# Altium schematic sheet ssegs_and_registers.SchDoc
size A; SheetNumber: 3; SheetTotal: 4
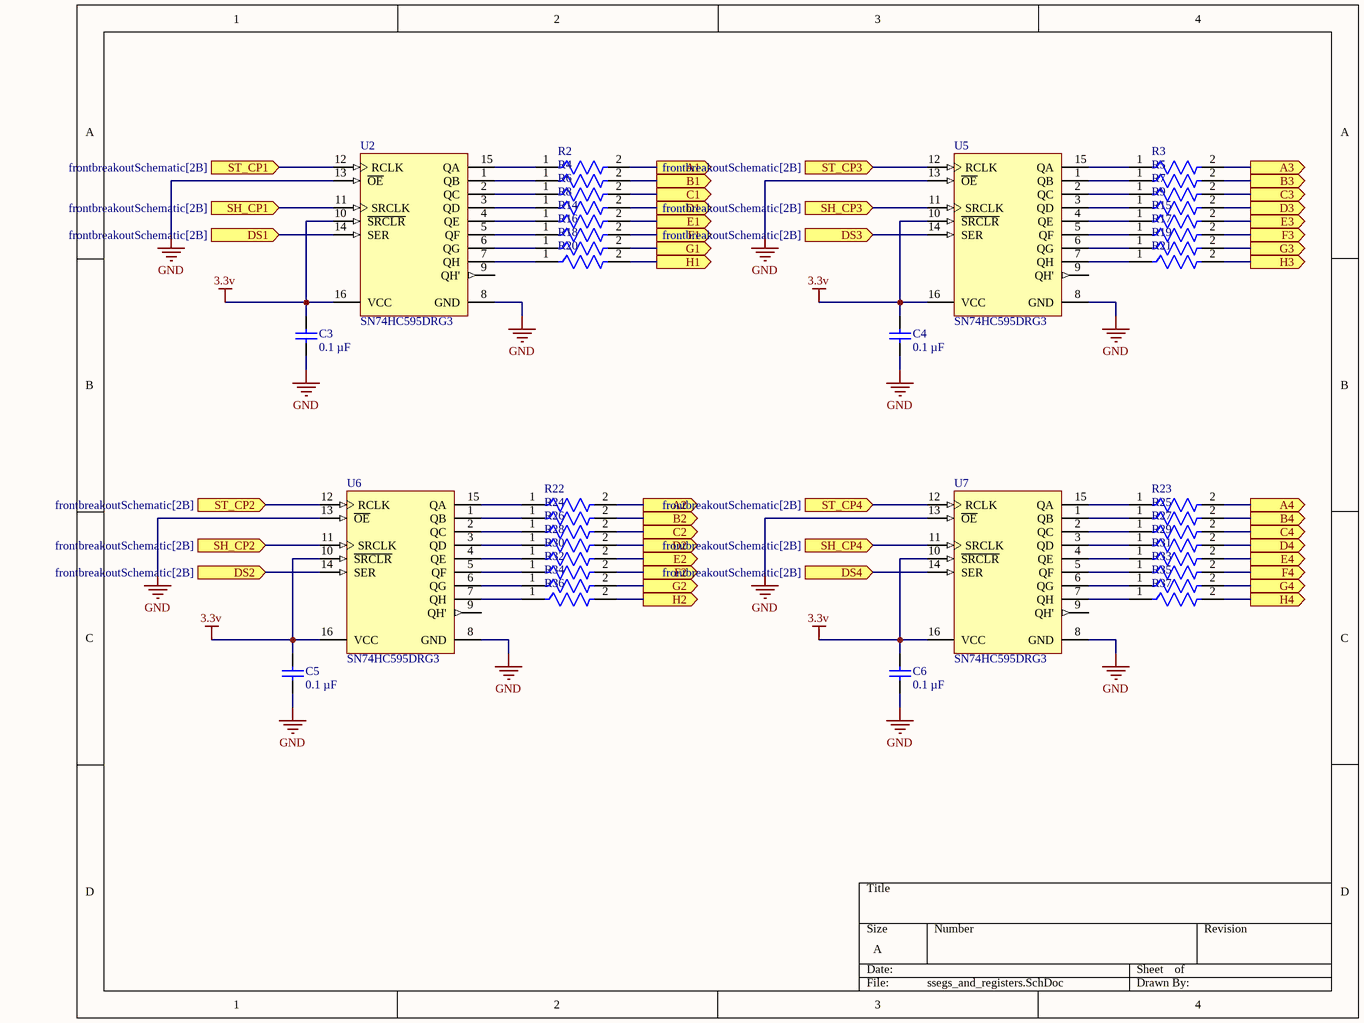
[diagram p0: ssegs_and_registers.SchDoc]

## Parts
C3  0.1 µF  [CAPC2013X140X50NL20T25]
C4  0.1 µF  [CAPC2013X140X50NL20T25]
C5  0.1 µF  [CAPC2013X140X50NL20T25]
C6  0.1 µF  [CAPC2013X140X50NL20T25]
R2  200  [FP-RG2012-IPC_A]  (value not drawn)
R3  200  [FP-RG2012-IPC_A]  (value not drawn)
R4  200  [FP-RG2012-IPC_A]  (value not drawn)
R5  200  [FP-RG2012-IPC_A]  (value not drawn)
R6  200  [FP-RG2012-IPC_A]  (value not drawn)
R7  200  [FP-RG2012-IPC_A]  (value not drawn)
R8  200  [FP-RG2012-IPC_A]  (value not drawn)
R9  200  [FP-RG2012-IPC_A]  (value not drawn)
R14  200  [FP-RG2012-IPC_A]  (value not drawn)
R15  200  [FP-RG2012-IPC_A]  (value not drawn)
R16  200  [FP-RG2012-IPC_A]  (value not drawn)
R17  200  [FP-RG2012-IPC_A]  (value not drawn)
R18  200  [FP-RG2012-IPC_A]  (value not drawn)
R19  200  [FP-RG2012-IPC_A]  (value not drawn)
R20  200  [FP-RG2012-IPC_A]  (value not drawn)
R21  200  [FP-RG2012-IPC_A]  (value not drawn)
R22  200  [FP-RG2012-IPC_A]  (value not drawn)
R23  200  [FP-RG2012-IPC_A]  (value not drawn)
R24  200  [FP-RG2012-IPC_A]  (value not drawn)
R25  200  [FP-RG2012-IPC_A]  (value not drawn)
R26  200  [FP-RG2012-IPC_A]  (value not drawn)
R27  200  [FP-RG2012-IPC_A]  (value not drawn)
R28  200  [FP-RG2012-IPC_A]  (value not drawn)
R29  200  [FP-RG2012-IPC_A]  (value not drawn)
R30  200  [FP-RG2012-IPC_A]  (value not drawn)
R31  200  [FP-RG2012-IPC_A]  (value not drawn)
R32  200  [FP-RG2012-IPC_A]  (value not drawn)
R33  200  [FP-RG2012-IPC_A]  (value not drawn)
R34  200  [FP-RG2012-IPC_A]  (value not drawn)
R35  200  [FP-RG2012-IPC_A]  (value not drawn)
R36  200  [FP-RG2012-IPC_A]  (value not drawn)
R37  200  [FP-RG2012-IPC_A]  (value not drawn)
U2  SN74HC595DRG3  [D0016A_L]
U5  SN74HC595DRG3  [D0016A_L]
U6  SN74HC595DRG3  [D0016A_L]
U7  SN74HC595DRG3  [D0016A_L]

## Ports
A1 (out, see SEX[2A]), A2 (out, see SEX[4A]), A3 (out, see SEX[2B]), A4 (out, see SEX[4B]), B1 (out, see SEX[2A]), B2 (out, see SEX[4A]), B3 (out, see SEX[2B]), B4 (out, see SEX[4B]), C1 (out, see SEX[1A]), C2 (out, see SEX[3A]), C3 (out, see SEX[1B]), C4 (out, see SEX[3B]), D1 (out, see SEX[1A]), D2 (out, see SEX[3A]), D3 (out, see SEX[1B]), D4 (out, see SEX[3B]), DS1 (in, see frontbreakoutSchematic[2B]), DS2 (in, see frontbreakoutSchematic[2B]), DS3 (in, see frontbreakoutSchematic[2B]), DS4 (in, see frontbreakoutSchematic[2B]), E1 (out, see SEX[1A]), E2 (out, see SEX[3A]), E3 (out, see SEX[1B]), E4 (out, see SEX[3B]), F1 (out, see SEX[2A]), F2 (out, see SEX[4A]), F3 (out, see SEX[2B]), F4 (out, see SEX[4B]), G1 (out, see SEX[2A]), G2 (out, see SEX[4A]), G3 (out, see SEX[2B]), G4 (out, see SEX[4B]), H1 (out, see SEX[1A]), H2 (out, see SEX[3A]), H3 (out, see SEX[1B]), H4 (out, see SEX[3B]), SH_CP1 (in, see frontbreakoutSchematic[2B]), SH_CP2 (in, see frontbreakoutSchematic[2B]), SH_CP3 (in, see frontbreakoutSchematic[2B]), SH_CP4 (in, see frontbreakoutSchematic[2B]), ST_CP1 (in, see frontbreakoutSchematic[2B]), ST_CP2 (in, see frontbreakoutSchematic[2B]), ST_CP3 (in, see frontbreakoutSchematic[2B]), ST_CP4 (in, see frontbreakoutSchematic[2B])

## Nets
3.3v: C3.1 C4.1 C5.1 C6.1 U2.10(~{SRCLR}) U2.16(VCC) U5.10(~{SRCLR}) U5.16(VCC) U6.10(~{SRCLR}) U6.16(VCC) U7.10(~{SRCLR}) U7.16(VCC)
GND: C3.2 C4.2 C5.2 C6.2 U2.8(GND) U2.13(~{OE}) U5.8(GND) U5.13(~{OE}) U6.8(GND) U6.13(~{OE}) U7.8(GND) U7.13(~{OE})
A1: R2.2 ; port A1
A2: R22.2 ; port A2
A3: R3.2 ; port A3
A4: R23.2 ; port A4
B1: R4.2 ; port B1
B2: R24.2 ; port B2
B3: R5.2 ; port B3
B4: R25.2 ; port B4
C1: R6.2 ; port C1
C2: R26.2 ; port C2
C3: R7.2 ; port C3
C4: R27.2 ; port C4
D1: R8.2 ; port D1
D2: R28.2 ; port D2
D3: R9.2 ; port D3
D4: R29.2 ; port D4
DS1: U2.14(SER) ; port DS1
DS2: U6.14(SER) ; port DS2
DS3: U5.14(SER) ; port DS3
DS4: U7.14(SER) ; port DS4
E1: R14.2 ; port E1
E2: R30.2 ; port E2
E3: R15.2 ; port E3
E4: R31.2 ; port E4
F1: R16.2 ; port F1
F2: R32.2 ; port F2
F3: R17.2 ; port F3
F4: R33.2 ; port F4
G1: R18.2 ; port G1
G2: R34.2 ; port G2
G3: R19.2 ; port G3
G4: R35.2 ; port G4
H1: R20.2 ; port H1
H2: R36.2 ; port H2
H3: R21.2 ; port H3
H4: R37.2 ; port H4
SH_CP1: U2.11(SRCLK) ; port SH_CP1
SH_CP2: U6.11(SRCLK) ; port SH_CP2
SH_CP3: U5.11(SRCLK) ; port SH_CP3
SH_CP4: U7.11(SRCLK) ; port SH_CP4
ST_CP1: U2.12(RCLK) ; port ST_CP1
ST_CP2: U6.12(RCLK) ; port ST_CP2
ST_CP3: U5.12(RCLK) ; port ST_CP3
ST_CP4: U7.12(RCLK) ; port ST_CP4
NetR2_1: R2.1 U2.15(QA)
NetR3_1: R3.1 U5.15(QA)
NetR4_1: R4.1 U2.1(QB)
NetR5_1: R5.1 U5.1(QB)
NetR6_1: R6.1 U2.2(QC)
NetR7_1: R7.1 U5.2(QC)
NetR8_1: R8.1 U2.3(QD)
NetR9_1: R9.1 U5.3(QD)
NetR14_1: R14.1 U2.4(QE)
NetR15_1: R15.1 U5.4(QE)
NetR16_1: R16.1 U2.5(QF)
NetR17_1: R17.1 U5.5(QF)
NetR18_1: R18.1 U2.6(QG)
NetR19_1: R19.1 U5.6(QG)
NetR20_1: R20.1 U2.7(QH)
NetR21_1: R21.1 U5.7(QH)
NetR22_1: R22.1 U6.15(QA)
NetR23_1: R23.1 U7.15(QA)
NetR24_1: R24.1 U6.1(QB)
NetR25_1: R25.1 U7.1(QB)
NetR26_1: R26.1 U6.2(QC)
NetR27_1: R27.1 U7.2(QC)
NetR28_1: R28.1 U6.3(QD)
NetR29_1: R29.1 U7.3(QD)
NetR30_1: R30.1 U6.4(QE)
NetR31_1: R31.1 U7.4(QE)
NetR32_1: R32.1 U6.5(QF)
NetR33_1: R33.1 U7.5(QF)
NetR34_1: R34.1 U6.6(QG)
NetR35_1: R35.1 U7.6(QG)
NetR36_1: R36.1 U6.7(QH)
NetR37_1: R37.1 U7.7(QH)

Not connected (* = marked no-connect by the designer): U2 9(QH'); U5 9(QH'); U6 9(QH'); U7 9(QH')

## Library data of the parts
C3-C6 = CMP-2007-04629-1: Part Number: 08055C104K4Z2A; Manufacturer: AVX Interconnect / Elco
R2-R9 R14-R37 = CMP-2001-02821-2: Automotive Metal Thin Film Chip Resistor, 0805, 200Ω, 0.1%, 25ppm/°C, 0.125W, 150VRG2012P-201-B-T5; Voltage Rating (DC): 150V; Voltage Rating: 100V; Resistance: 200R; Max Power Dissipation: 125mW; Power Rating: 100mW; Termination: SMD/SMT; Size Code: 0805; Tolerance: 0.1%; Length: 2mm; Width: 1.25mm; Case Code (Metric): 2012; Package Quantity: 5000; Temperature Coefficient: 25ppm/°C; Case/Package: 0805; Packaging: Tape and Reel; Max Operating Temperature: 155°C; Lead Free: Lead Free; RoHS Compliant: Yes; Height: 0.4mm; Series: RG; Case Code (Imperial): 0805; Number of Terminations: 2; Min Operating Temperature: -55°C; Features: Automotive AEC-Q200
U2 U5-U7 = CMP-0780-00040-3: 8-Bit Shift Registers With 3-State Output Registers, D0016A, LARGE T&R; Manufacturer: Texas Instruments; F @ Nom Voltage(Max)(Mhz): 28; Input Type: CMOS; Rating: Military; VCC(Max)(V): 6; VCC(Min)(V): 2; Technology Family: HC; 3-State Output: Yes; tpd @ Nom Voltage(Max)(ns): 34; ICC @ Nom Voltage(Max)(mA): 0.08; Output Drive (IOL/IOH)(Max)(mA): 7.8/-7.8; Bits: 8; DatasheetVersion: SCLS041H; Operating Temperature Range(C): -40 to 85; Code_JEDEC: MS-012 variation AC; Voltage(Nom)(V): 6; Output Type: CMOS; PackageVersion: http://www.ti.com/lit/ml/mpds178g/mpds178g.pdf; Generic Part Number: SN74HC595; PackageReference: D0016A